# Altium project RUT_L865_V4.PrjPCB
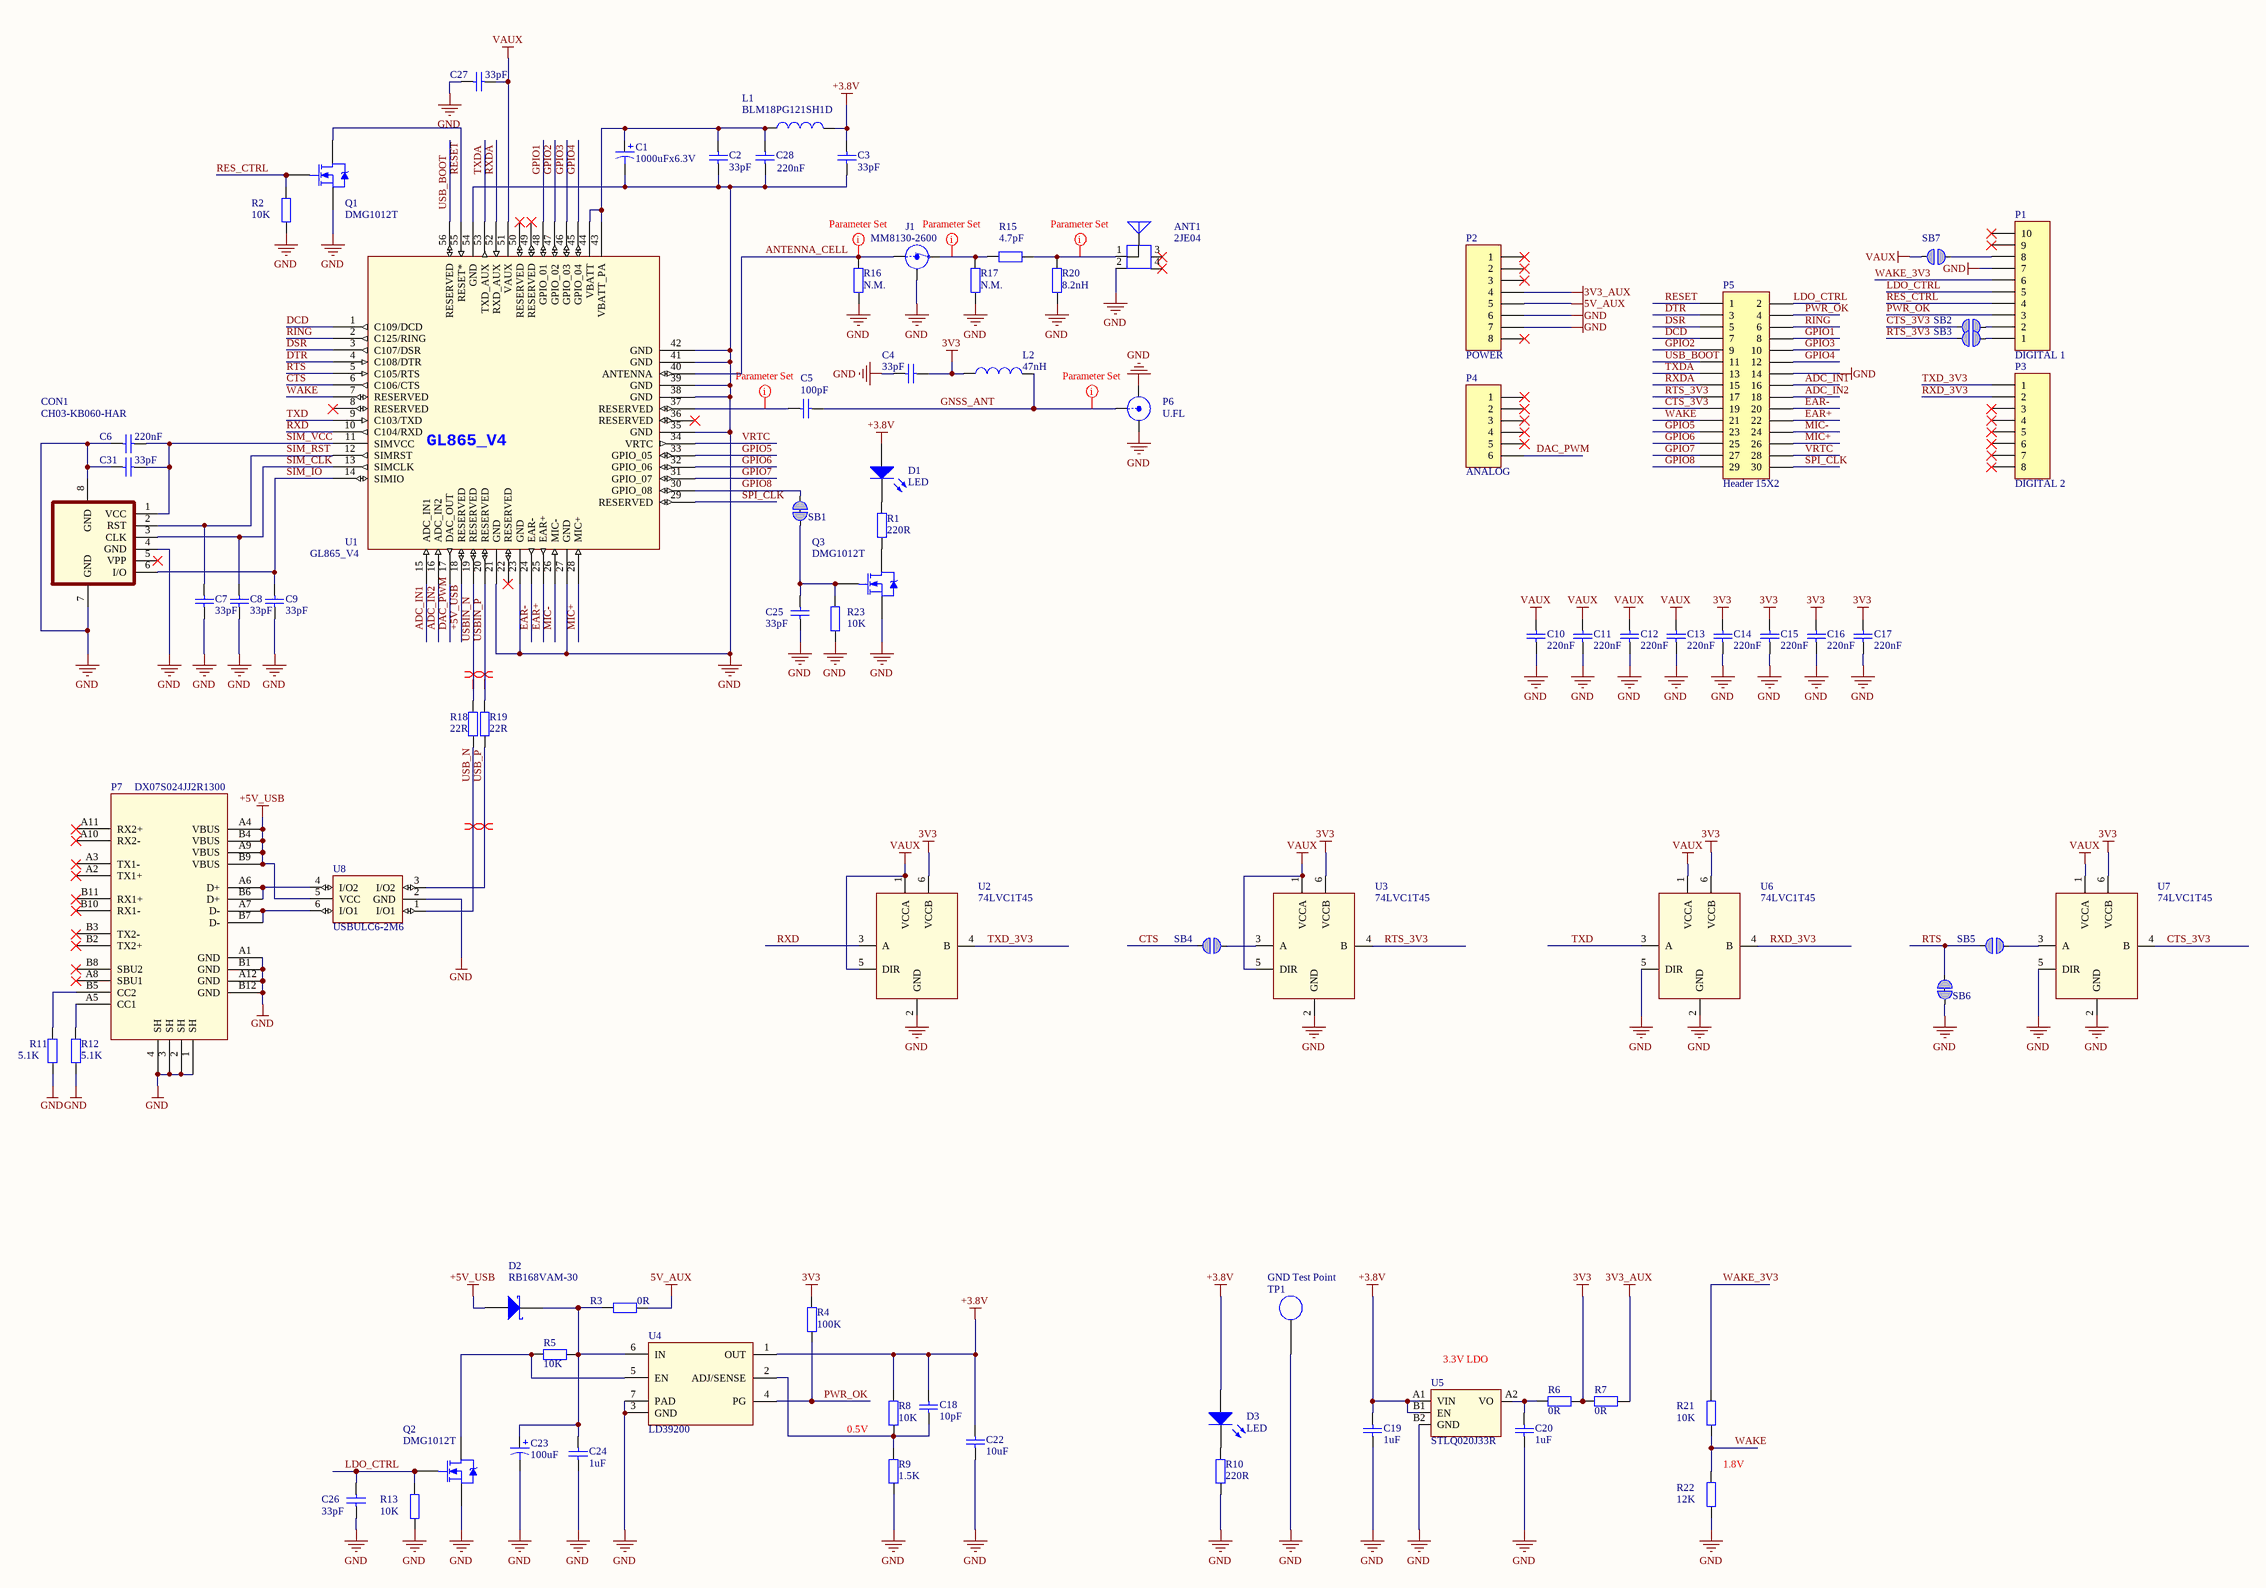
[diagram p0: Main Schematic.SchDoc]
1 sheet, 84 parts. Net scope: global (net labels, ports and power ports of the same name join across sheets).
Board files: L865_V4_PCB.PcbDoc, L865_V4_PCB_panel.PcbDoc

## Sheet Main Schematic.SchDoc: GL865 QUAD V4 Modem
size A2; DrawnBy: Gintaras Drukteinis; Revision: Rev2

### Parts
ANT1  2JE04  [2JE04]
C1  value 1000uFx6.3V  [7361-38]  (hidden comment: electrolytic capacitor)
C2  value 33pF  [C0402]  (hidden comment: Cap Semi)
C3  value 33pF  [C0402]  (hidden comment: Cap Semi)
C4  value 33pF  [C0402]  (hidden comment: Cap Semi)
C5  value 100pF  [C0402]  (hidden comment: Cap Semi)
C6  value 220nF  [C0402]  (hidden comment: Cap Semi)
C7  value 33pF  [C0402]  (hidden comment: Cap Semi)
C8  value 33pF  [C0402]  (hidden comment: Cap Semi)
C9  value 33pF  [C0402]  (hidden comment: Cap Semi)
C10  value 220nF  [C0402]  (hidden comment: Cap Semi)
C11  value 220nF  [C0402]  (hidden comment: Cap Semi)
C12  value 220nF  [C0402]  (hidden comment: Cap Semi)
C13  value 220nF  [C0402]  (hidden comment: Cap Semi)
C14  value 220nF  [C0402]  (hidden comment: Cap Semi)
C15  value 220nF  [C0402]  (hidden comment: Cap Semi)
C16  value 220nF  [C0402]  (hidden comment: Cap Semi)
C17  value 220nF  [C0402]  (hidden comment: Cap Semi)
C18  value 10pF  [C0402]  (hidden comment: Cap Semi)
C19  value 1uF  [C0402]  (hidden comment: Cap Semi)
C20  value 1uF  [C0402]  (hidden comment: Cap Semi)
C22  value 10uF  [C0402]  (hidden comment: Cap Semi)
C23  value 100uF  [Case-B]  (hidden comment: electrolytic capacitor)
C24  value 1uF  [C0402]  (hidden comment: Cap Semi)
C25  value 33pF  [C0402]  (hidden comment: Cap Semi)
C26  value 33pF  [C0402]  (hidden comment: Cap Semi)
C27  value 33pF  [C0402]  (hidden comment: Cap Semi)
C28  value 220nF  [C0402]  (hidden comment: Cap Semi)
C31  value 33pF  [C0402]  (hidden comment: Cap Semi)
CON1  CH03-KB060-HAR  [CH03-KB]
D1  LED  [LED0805]
D2  RB168VAM-30  [SOD323]
D3  LED  [LED0805]
J1  MM8130-2600  [COAXIAL-SWF]
L1  value BLM18PG121SH1D  [L0603]  (hidden comment: Inductor)
L2  value 47nH  [L0402]  (hidden comment: Inductor)
P1  DIGITAL 1  [HDR1X10]
P2  POWER  [HDR1X8]  (no BOM)
P3  DIGITAL 2  [HDR1X8]  (no BOM)
P4  ANALOG  [HDR1X6]  (no BOM)
P5  Header 15X2  [HDR2X15]  (no BOM)
P6  U.FL  [U.FL_Connector_Male]
P7  DX07S024JJ2R1300  [DX07_USB_C]
Q1  DMG1012T  [SOT-523_custom]
Q2  DMG1012T  [SOT-523_custom]
Q3  DMG1012T  [SOT-523_custom]
R1  value 220R  [R0402]  (hidden comment: Res2)
R2  value 10K  [R0402]  (hidden comment: Res2)
R3  value 0R  [R0402]  (hidden comment: Res2)
R4  value 100K  [R0402]  (hidden comment: Res2)
R5  value 10K  [R0402]  (hidden comment: Res2)
R6  value 0R  [R0402]  (hidden comment: Res2)
R7  value 0R  [R0402]  (hidden comment: Res2)
R8  value 10K  [R0402]  (hidden comment: Res2)
R9  value 1.5K  [R0402]  (hidden comment: Res2)
R10  value 220R  [R0402]  (hidden comment: Res2)
R11  value 5.1K  [R0402]  (hidden comment: Res2)
R12  value 5.1K  [R0402]  (hidden comment: Res2)
R13  value 10K  [R0402]  (hidden comment: Res2)
R15  value 4.7pF  [R0402]  (hidden comment: Res2)
R16  value N.M.  [R0402]  (hidden comment: Res2)  (no BOM)
R17  value N.M.  [R0402]  (hidden comment: Res2)  (no BOM)
R18  value 22R  [R0402]  (hidden comment: Res2)
R19  value 22R  [R0402]  (hidden comment: Res2)
R20  value 8.2nH  [R0402]  (hidden comment: Res2)
R21  value 10K  [R0402]  (hidden comment: Res2)  (no BOM)
R22  value 12K  [R0402]  (hidden comment: Res2)  (no BOM)
R23  value 10K  [R0402]  (hidden comment: Res2)
SB1  Solderbridge  [Solderbridge_Shorted]  (value not drawn)  (net tie, no BOM)
SB2  Solderbridge  [Solderbridge]  (value not drawn)  (no BOM)
SB3  Solderbridge  [Solderbridge]  (value not drawn)  (no BOM)
SB4  Solderbridge  [Solderbridge]  (value not drawn)  (no BOM)
SB5  Solderbridge  [Solderbridge]  (value not drawn)  (no BOM)
SB6  Solderbridge  [Solderbridge_Shorted]  (value not drawn)  (net tie, no BOM)
SB7  Solderbridge  [Solderbridge]  (value not drawn)  (no BOM)
TP1  GND Test Point  [5019_keystone]
U1  GL865_V4  [GL865_V4]
U2  74LVC1T45  [SOT23-6_custom]
U3  74LVC1T45  [SOT23-6_custom]
U4  LD39200  [DFN6]
U5  STLQ020J33R  [Flip-Chip4]
U6  74LVC1T45  [SOT23-6_custom]
U7  74LVC1T45  [SOT23-6_custom]
U8  USBULC6-2M6  [Micro_QFN_6L]

### Nets
3V3: C4.1 C14.1 C15.1 C16.1 C17.1 L2.1 R4.2 R6.1 R7.2 U2.6(VCCB) U3.6(VCCB) U6.6(VCCB) U7.6(VCCB)
3V3_AUX: P2.4 R7.1
5V_AUX: P2.5 R3.1
+3.8V: C3.2 C18.2 C19.1 C22.2 D1.1(A) D3.1(A) L1.2 R8.1 U4.1(OUT) U5.A1(VIN) U5.B1(EN)
+5V_USB: D2.1(A) P7.A4(VBUS) P7.A9(VBUS) P7.B4(VBUS) P7.B9(VBUS) U1.18(RESERVED) U8.5(VCC)
GND: ANT1.2 C1.2 C2.1 C3.1 C4.2 C6.2 C7.2 C8.2 C9.2 C10.2 C11.2 C12.2 C13.2 C14.2 C15.2 C16.2 C17.2 C19.2 C20.2 C22.1 C23.2 C24.1 C25.2 C26.2 C27.2 C28.2 C31.2 CON1.4(GND) CON1.7(GND) CON1.8(GND) J1.2(Shield) P1.7 P2.6 P2.7 P5.14 P6.2(Y) P6.3(Y) P7.1(SH) P7.2(SH) P7.3(SH) P7.4(SH) P7.A1(GND) P7.A12(GND) P7.B1(GND) P7.B12(GND) Q1.3(S) Q2.3(S) Q3.3(S) R2.1 R9.2 R10.2 R11.1 R12.1 R13.1 R16.2 R17.2 R20.2 R22.1 R23.1 SB6.2 TP1.1 U1.21(GND) U1.23(GND) U1.27(GND) U1.35(GND) U1.38(GND) U1.39(GND) U1.41(GND) U1.42(GND) U1.54(GND) U2.2(GND) U3.2(GND) U4.3(GND) U4.7(PAD) U5.B2(GND) U6.2(GND) U6.5(DIR) U7.2(GND) U7.5(DIR) U8.2(GND)
VAUX: C10.1 C11.1 C12.1 C13.1 C27.1 SB7.1 U1.51(VAUX) U2.1(VCCA) U2.5(DIR) U3.1(VCCA) U3.5(DIR) U6.1(VCCA) U7.1(VCCA)
ADC_IN1: P5.16 U1.15(ADC_IN1)
ADC_IN2: P5.18 U1.16(ADC_IN2)
ANTENNA_CELL: J1.1(IN) R16.1 U1.40(ANTENNA)
CTS: SB4.1 U1.6(C106/CTS)
CTS_3V3: P5.19 SB2.1 U7.4(B)
DAC_PWM: P4.6 U1.17(DAC_OUT)
DCD: P5.7 U1.1(C109/DCD)
DSR: P5.5 U1.3(C107/DSR)
DTR: P5.3 U1.4(C108/DTR)
EAR+: P5.22 U1.25(EAR+)
EAR-: P5.20 U1.24(EAR-)
GNSS_ANT: C5.1 L2.2 P6.1(X)
GPIO1: P5.8 U1.48(GPIO_01)
GPIO2: P5.9 U1.47(GPIO_02)
GPIO3: P5.10 U1.46(GPIO_03)
GPIO4: P5.12 U1.45(GPIO_04)
GPIO5: P5.23 U1.33(GPIO_05)
GPIO6: P5.25 U1.32(GPIO_06)
GPIO7: P5.27 U1.31(GPIO_07)
GPIO8: P5.29 SB1.1 U1.30(GPIO_08)
LDO_CTRL: C26.1 P1.5 P5.2 Q2.1(G) R13.2
MIC+: P5.26 U1.28(MIC+)
MIC-: P5.24 U1.26(MIC-)
PWR_OK: P1.3 P5.4 R4.1 U4.4(PG)
RES_CTRL: P1.4 Q1.1(G) R2.2
RESET: P5.1 Q1.2(D) U1.55(RESET*)
RING: P5.6 U1.2(C125/RING)
RTS: SB5.1 SB6.1 U1.5(C105/RTS)
RTS_3V3: P5.17 SB3.1 U3.4(B)
RXD: U1.10(C104/RXD) U2.3(A)
RXD_3V3: P3.2 U6.4(B)
RXDA: P5.15 U1.52(RXD_AUX)
SIM_CLK: C8.1 CON1.3(CLK) U1.13(SIMCLK)
SIM_IO: C9.1 CON1.6(I/O) U1.14(SIMIO)
SIM_RST: C7.1 CON1.2(RST) U1.12(SIMRST)
SIM_VCC: C6.1 C31.1 CON1.1(VCC) U1.11(SIMVCC)
SPI_CLK: P5.30 U1.29(RESERVED)
TXD: U1.9(C103/TXD) U6.3(A)
TXD_3V3: P3.1 U2.4(B)
TXDA: P5.13 U1.53(TXD_AUX)
USB_BOOT: P5.11 U1.56(RESERVED)
USB_N: R18.2 U8.1(I/O1)
USB_P: R19.2 U8.3(I/O2)
USBIN_N: R18.1 U1.19(RESERVED)
USBIN_P: R19.1 U1.20(RESERVED)
VRTC: P5.28 U1.34(VRTC)
WAKE: P5.21 R21.1 R22.2 U1.7(RESERVED)
WAKE_3V3: P1.6 R21.2
NetANT1_1: ANT1.1 R15.2 R20.1
NetC1_1: C1.1 C2.2 C28.1 L1.1 U1.43(VBATT_PA) U1.44(VBATT)
NetC5_2: C5.2 U1.37(RESERVED)
NetC18_1: C18.1 R8.2 R9.1 U4.2(ADJ/SENSE)
NetC20_1: C20.1 R6.2 U5.A2(VO)
NetC23_1: C23.1 C24.2 D2.2(K) R3.2 R5.2 U4.6(IN)
NetC25_1: C25.1 Q3.1(G) R23.2 SB1.2
NetD1_2: D1.2(K) R1.1
NetD3_2: D3.2(K) R10.1
NetJ1_3: J1.3(OUT) R15.1 R17.1
NetP1_1: P1.1 SB3.2
NetP1_2: P1.2 SB2.2
NetP1_8: P1.8 SB7.2
NetP7_A5: P7.A5(CC1) R12.2
NetP7_A6: P7.A6(D+) P7.B6(D+) U8.4(I/O2)
NetP7_A7: P7.A7(D-) P7.B7(D-) U8.6(I/O1)
NetP7_B5: P7.B5(CC2) R11.2
NetQ2_2: Q2.2(D) R5.1 U4.5(EN)
NetQ3_2: Q3.2(D) R1.2
NetSB4_2: SB4.2 U3.3(A)
NetSB5_2: SB5.2 U7.3(A)

Not connected (* = marked no-connect by the designer): ANT1 3* 4*; CON1 5(VPP)*; P1 9* 10*; P2 1* 2* 3* 8*; P3 3* 4* 5* 6* 7* 8*; P4 1* 2* 3* 4* 5*; P7 A2(TX1+)* A3(TX1-)* A8(SBU1)* A10(RX2-)* A11(RX2+)* B2(TX2+)* B3(TX2-)* B8(SBU2)* B10(RX1-)* B11(RX1+)*; U1 8(RESERVED)* 22(RESERVED)* 36(RESERVED)* 49(RESERVED)* 50(RESERVED)*

### Layout directives
rule Clearance Constraint [Clearance = 0.2mm]; rule Width Constraint [Pref Width = 1.1mm    Min Width = 1.1mm    Max Width = 1.1mm]: ANTENNA_CELL, GNSS_ANT, NetC5_2, NetJ1_3
rule Clearance Constraint [Clearance = 0.2mm]: NetANT1_1
differential pair: USB_N, USB_P, USBIN_N, USBIN_P

### Notes on the sheet
- (near U5) 3.3V LDO
- 0.5V
- (near R22) 1.8V

### Library data of the parts
ANT1 = Antenna: Generic Antenna; Manufacturer: 2J; Part Description: Quad Band Antenna; Specification: GSM850, GSM900, DCS, PCS, UMTS; Manufacturer Part No.: 2JE04; Supplier: Rutronik; Supplier part number: WIREAC1582; Value: 2JE04; Link: https://www.rutronik24.com/product/2j/2je04/947865.html
C1 = Cap Pol1: Manufacturer: AVX; Manufacturer Part No.: TPSV108M006R0050; Part Description: Tantalum Capacitor; Specification: 6,3V 20%; Supplier: Rutronik; Supplier part number: TPSV108M006R0050; Link: https://www.rutronik24.com/product/avx/tpsv108m006r0050/11647835.html
C2-C4 C7-C9 C25 C27 C31 = Cap Semi: Capacitor (Semiconductor SIM Model); Manufacturer: AVX; Manufacturer Part No.: 04025A330JAT2A; Part Description: Ceramic Capacitor; Specification: NP0, 6.3V, 5%; Supplier: Rutronik; Supplier part number: KKK13594; Link: https://www.rutronik24.com/product/avx/04025a330jat2a/3692730.html
C5 = Cap Semi: Capacitor (Semiconductor SIM Model); Manufacturer: Samsung Electronics; Manufacturer Part No.: CL05C101JB5NNNC; Part Description: Ceramic Capacitor; Specification: NP0, 6.3V, 5%; Supplier: Rutronik; Supplier part number: KKK14878; Link: https://www.rutronik24.com/product/samsung+em/cl05c101jb5nnnc/29858.html
C6 C10-C17 C28 = Cap Semi: Capacitor (Semiconductor SIM Model); Manufacturer: YAGEO; Manufacturer Part No.: CC0402KRX5R5BB224; Part Description: Ceramic Capacitor; Specification: X5R, 6.3V, 10%; Supplier: Rutronik; Supplier part number: KKK23148; Link: https://www.rutronik24.com/product/yageo/cc0402krx5r5bb224/3611951.html
C18 C26 = Cap Semi: Capacitor (Semiconductor SIM Model); Manufacturer: YAGEO; Manufacturer Part No.: CC0402JRNPO9BN100; Part Description: Ceramic Capacitor; Specification: NP0, 6.3V, 5%; Supplier: Rutronik; Supplier part number: KKK14556; Link: https://www.rutronik24.com/product/yageo/cc0402jrnpo9bn100/29735.html
C19 C20 = Cap Semi: Capacitor (Semiconductor SIM Model); Manufacturer: Samsung Electronics; Manufacturer Part No.: CL05A225MQ5NNNC; Part Description: Ceramic Capacitor; Specification: X5R, 6.3V, 10%; Supplier: Rutronik; Supplier part number: KKS2678; Link: https://www.rutronik24.com/product/samsung+em/cl05a225mq5nnnc/32280.html
C22 C24 = Cap Semi: Capacitor (Semiconductor SIM Model); Manufacturer: Samsung Electronics; Manufacturer Part No.: CL05A106MP5NUNC; Part Description: Ceramic Capacitor; Specification: X5R, 6.3V, 20%; Supplier: Rutronik; Supplier part number: KKS2857; Link: https://www.rutronik24.com/product/samsung+em/cl05a106mp5nunc/32408.html
C23 = Cap Pol1: Manufacturer: AVX; Manufacturer Part No.: TPSB107K006R0400; Part Description: Tantalum Capacitor; Specification: 6,3V 20%; Supplier: Rutronik; Supplier part number: KTA5959; Link: https://www.rutronik24.com/product/avx/tpsb107k006r0400/3688840.html
CON1 = CH03-KB060-HAR: Nano SIM Card Connector; Manufacturer: GradConn; Specification: Nano, 6 pins; Manufacturer Part No.: CH03-KB060-HAR; Supplier: Rutronik; Supplier part number: SIMCRD1002; Value: CH03-KB060-HAR; Part Description: Nano SIM Card Connector; Link: https://www.rutronik24.com/product/gradconn/ch03-kb060-har/7026333.html
D1 D3 = LED2: Typical SMD LED; Manufacturer: LITE ON; Manufacturer Part No.: LTST-C170KGKT; Specification: Green, 20mA; Value: LTST-C170KGKT; Supplier: Rutronik; Supplier part number: LED7323; Part Description: Typical SMD LED; Link: https://www.rutronik24.com/product/liteon/ltst-c170kgkt/33908.html
D2 = D Schottky: Schottky Diode; Manufacturer: ROHM; Part Description: Low VF Schottky Barrier Rectifier; Specification: 30V, 1A; Manufacturer Part No.: RB168VAM-30; Supplier: Rutronik; Supplier part number: RB168VAM-30; Value: RB168VAM-30; Link: http://rohmfs.rohm.com/en/products/databook/datasheet/discrete/diode/schottky_barrier/rb168vam-30tr-e.pdf
J1 = MM8130-2600: Coaxial Connector with Switch; Manufacturer: Murata; Manufacturer Part No.: MM8130-2600RB8; Part Description: Microwave Coaxial Connector with Switch; Specification: 50Ohm, 6GHz; Value: MM8130-2600; Supplier: Rutronik; Supplier part number: MM8130-2600RB8; Link: https://www.murata.com/~/media/webrenewal/support/library/catalog/products/switch/switch/o33e.ashx
L1 = Inductor: Manufacturer: muRata; Part Description: Ferrite Bead; Specification: 120R, 2A; Manufacturer Part No.: BLM18PG121SH1D; Supplier: Rutronik; Supplier part number: FE3867; Link: https://www.rutronik24.com/product/murata/blm18pg121sh1d/5885588.html
L2 = Inductor: Manufacturer: muRata; Manufacturer Part No.: LQW15AN47NJ00D; Part Description: Chip Inductor; Specification: 210mA, 5%; Supplier: Rutronik; Supplier part number: IND12619; Link: https://www.rutronik24.com/product/murata/lqw15an47nj00d/4251385.html
P1 = Header 10: Manufacturer: SparkFun Electronics; Manufacturer Part No.: PRT-11417; Part Description: Arduino Stackable Header Kit; Specification: 10 pins; Value: PRT-11417; Supplier: Digi-Key; Supplier part number: 1568-1413-ND
P2 P3 = Header 8: Part Description: Arduino Connector; Specification: 8 pins
P4 = Header 6: Part Description: Arduino Connector; Specification: 6 pins
P5 = Header 15X2: Header, 15-Pin, Dual row
P6 = SMB: Manufacturer: HIROSE; Manufacturer Part No.: U.FL-R-SMT-1(10); Part Description: U.FL Connector; Specification: Male; Value: U.FL-R-SMT-1(10); Supplier: Rutronik; Supplier part number: COREC23028; Link: https://www.hirose.com/product/en/products/U.FL/U.FL-R-SMT-1%2810%29/
P7 = DX07S024JJ2R1300: 24P USB C DUAL SMT ON BOARD; Manufacturer: JAE; Specification: Type C; Link: https://www.rutronik24.com/product/jae/dx07s024jj2r1300/8301548.html; Manufacturer Part No.: DX07S024JJ2R1300; Part Description: 24P USB C DUAL SMT ON BOARD; Supplier: Rutronik; Supplier part number: CONIO1808; Value: DX07S024JJ2R1300
Q1-Q3 = NMOS-2: N-Channel Power MOSFET; Manufacturer: Diodes Inc.; Manufacturer Part No.: DMG1012T-7; Part Description: N-Channel MOSFET; Specification: 20V, 0.63A; Value: DMG1012T-7; Supplier: Rutronik; Supplier part number: TMOSS6623; Link: https://www.rutronik24.com/product/diodes+inc/dmg1012t-7/5168665.html
R1 R10 = Res2: Manufacturer: ASJ; Manufacturer Part No.: CR10-221-JK; Part Description: Thick Film Resistor; Specification: 5% 0,063W; Supplier: Rutronik; Supplier part number: WRC35108; Link: https://www.rutronik24.com/product/asj/cr10-221-jk/51883.html
R2 R5 R8 R11-R13 R21 R23 = Res2: Manufacturer: ASJ; Manufacturer Part No.: CR10-103-JK; Part Description: Thick Film Resistor; Specification: 5% 0,063W; Supplier: Rutronik; Supplier part number: WRC40976; Link: https://www.rutronik24.com/product/asj/cr10-103-jk/54295.html
R3 R6 R7 = Res2: Manufacturer: YAGEO; Manufacturer Part No.: RC0402FR-070RL; Part Description: Thick Film Resistor; Specification: 5% 0,063W; Supplier: Rutronik; Supplier part number: WRC53079; Link: https://www.rutronik24.com/product/yageo/rc0402fr-070rl/5183530.html
R4 = Res2: Manufacturer: ASJ; Manufacturer Part No.: CR10-104-JK; Part Description: Thick Film Resistor; Specification: 5% 0,063W; Supplier: Rutronik; Supplier part number: WRC34858; Link: https://www.rutronik24.com/product/asj/cr10-104-jk/51752.html
R9 = Res2: Manufacturer: YAGEO; Manufacturer Part No.: RC0402JR-071K5L; Part Description: Thick Film Resistor; Specification: 5% 0,063W; Supplier: Rutronik; Supplier part number: WRC33836; Link: https://www.rutronik24.com/product/yageo/rc0402jr-071k5l/51006.html
R15 = Res2: Manufacturer: Samsung Electronics; Manufacturer Part No.: CL05C4R7BB5NNNC; Part Description: Thick Film Resistor; Specification: 5% 0,063W; Supplier: Rutronik; Supplier part number: KKK19992; Link: https://www.rutronik24.com/product/samsung+em/cl05c4r7bb5nnnc/31228.html
R16 R17 = Res2: Part Description: Thick Film Resistor; Specification: 5% 0,063W
R18 R19 = Res2: Manufacturer: ASJ; Manufacturer Part No.: CR10-220-JK; Part Description: Thick Film Resistor; Specification: 5% 0,063W; Supplier: Rutronik; Supplier part number: WRC34862; Link: https://www.rutronik24.com/product/asj/cr10-220-jk/51754.html
R20 = Res2: Manufacturer: Samsung Electronics; Manufacturer Part No.: CIH05T8N2JNC; Part Description: Thick Film Resistor; Specification: 5% 0,063W; Supplier: Rutronik; Supplier part number: IND11143; Link: https://www.rutronik24.com/product/samsung+em/cih05t8n2jnc/24725.html
R22 = Res2: Manufacturer: ASJ; Manufacturer Part No.: CR10-123-JK; Part Description: Thick Film Resistor; Specification: 5% 0,063W; Supplier: Rutronik; Supplier part number: WRC35123; Link: https://www.rutronik24.com/product/asj/cr10-123-jk/51889.html
SB1 SB6 = Solderbridge Shorted: Manufacturer: *; Value: Solderbridge; Supplier: *; Supplier part number: *
TP1 = 5019: SMD Test Point; Manufacturer: Keystone Electrincs; Part Description: SMT Test Point; Specification: 3.81*2.03; Value: 5019; Manufacturer Part No.: 5019; Supplier: Rutronik; Supplier part number: BAT4950; Link: https://www.rutronik24.com/product/keystone/pn5019/7028403.html
U1 = GL865_V4: Manufacturer: Telit; Manufacturer Part No.: GL865Q4D401T001000; Part Description: Quad Band GSM Module; Specification: GSM900, GSM850, DCS1800, PCS1900; Value: GL865-QUAD V4; Supplier: Rutronik; Supplier part number: GSM1863; Link: https://www.rutronik24.com/product/telit/gl865q4d401t001000/10778489.html
U2 U3 U6 U7 = 74LVC1T45: Manufacturer: Diodes Inc.; Manufacturer Part No.: 74LVC1T45W6-7; Part Description: Single Bit Voltage Level Translator; Specification: 5.5V, 1.65V; Value: 74LVC1T45W6-7; Supplier: Rutronik; Supplier part number: ICLOG10709; Link: https://www.rutronik24.com/product/diodes+inc/74lvc1t45w6-7/7622634.html
U4 = LD39200: 2 A high PSRR ultra low drop linear regulator with reverse current protection; Manufacturer: STMicroelectronics; Manufacturer Part No.: LD39200PUR; Specification: 2A ADJ.; Value: LD39200PUR; Link: https://www.rutronik24.com/product/st/ld39200pur/8309892.html; Part Description: 2 A high PSRR ultra low drop linear regulator with reverse current protection; Supplier: Rutronik; Supplier part number: ICSPR10216
U5 = STLQ020: LDO; Manufacturer: STMicroelectronics; Part Description: 200 mA ultra-low quiescent current LDO; Specification: 3.3V, 200mA; Manufacturer Part No.: STLQ020J33R; Supplier: Rutronik; Supplier part number: STLQ020J33R; Value: STLQ020J33R; Link: https://www.rutronik24.com/product/st/stlq020j33r/12065124.html
U8 = USBULC6-2M6: Ultra large bandwidth ESD protection; Manufacturer: STMicroelectronics; Specification: 6V, 0.6pF; Link: https://www.rutronik24.com/product/st/usbulc6-2m6/3623499.html; Manufacturer Part No.: USBULC6-2M6; Part Description: Ultra large bandwidth ESD protection; Supplier: Rutronik; Supplier part number: DTRL11259; Value: USBULC6-2M6
SB2-SB5 SB7 = Solderbridge: Manufacturer: *; Value: Solderbridge; Supplier: *; Supplier part number: *